# Altium schematic sheet StatusLEDSchem.SchDoc
size A4; SheetNumber: 1; SheetTotal: 1
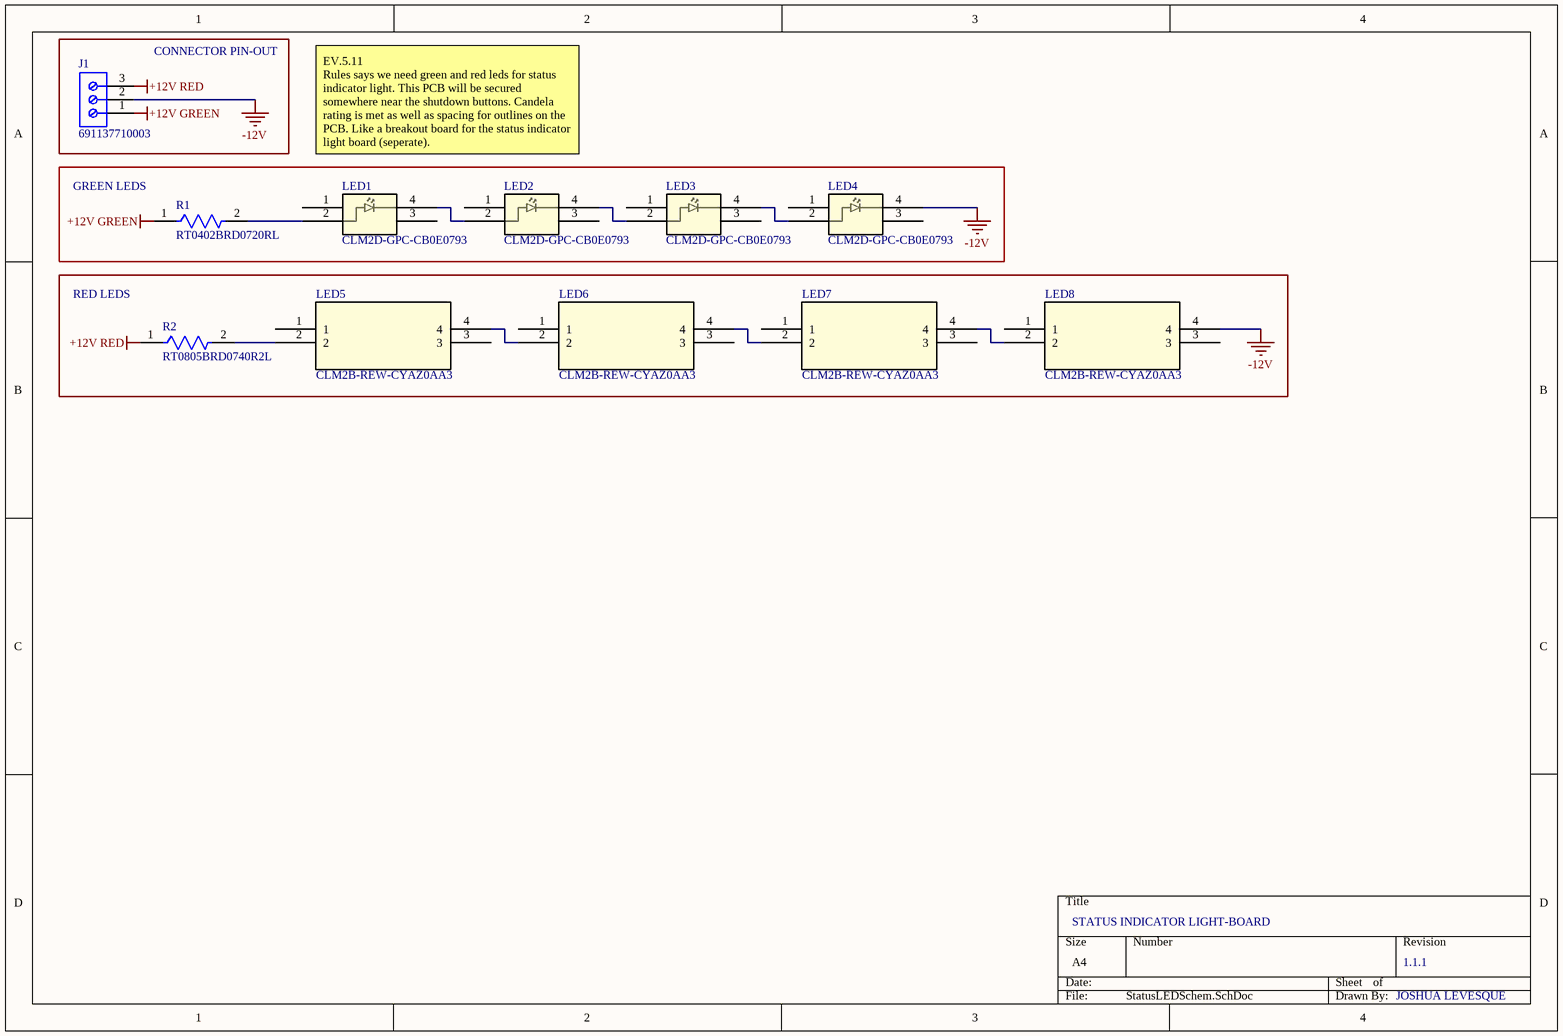
[diagram p0: StatusLEDSchem.SchDoc]

## Parts
J1  691137710003  [691137710003]
LED1  CLM2D-GPC-CB0E0793  [PLCC4_3.5X2.8X3.45_CRW]
LED2  CLM2D-GPC-CB0E0793  [PLCC4_3.5X2.8X3.45_CRW]
LED3  CLM2D-GPC-CB0E0793  [PLCC4_3.5X2.8X3.45_CRW]
LED4  CLM2D-GPC-CB0E0793  [PLCC4_3.5X2.8X3.45_CRW]
LED5  CLM2B-REW-CYAZ0AA3  [PLCC4_CLM2B_3P2X2P7_CRE]
LED6  CLM2B-REW-CYAZ0AA3  [PLCC4_CLM2B_3P2X2P7_CRE]
LED7  CLM2B-REW-CYAZ0AA3  [PLCC4_CLM2B_3P2X2P7_CRE]
LED8  CLM2B-REW-CYAZ0AA3  [PLCC4_CLM2B_3P2X2P7_CRE]
R1  RT0402BRD0720RL  [FP-RT0402-0_35-MFG]
R2  RT0805BRD0740R2L  [FP-RT0805-MFG]

## Blocks framed on the sheet
CONNECTOR PIN-OUT: J1
GREEN LEDS: LED1-LED4 R1
RED LEDS: LED5-LED8 R2

## Nets
+12V GREEN: J1.1 R1.1
+12V RED: J1.3 R2.1
-12V: J1.2 LED4.4 LED8.4
NetLED1_2: LED1.2 R1.2
NetLED1_4: LED1.4 LED2.2
NetLED2_4: LED2.4 LED3.2
NetLED3_4: LED3.4 LED4.2
NetLED5_2: LED5.2 R2.2
NetLED5_4: LED5.4 LED6.2
NetLED6_4: LED6.4 LED7.2
NetLED7_4: LED7.4 LED8.2

Not connected (* = marked no-connect by the designer): LED1 1 3; LED2 1 3; LED3 1 3; LED4 1 3; LED5 1 3; LED6 1 3; LED7 1 3; LED8 1 3

## Notes on the sheet
- EV.5.11
  Rules says we need green and red leds for status indicator light. This PCB will be secured somewhere near the shutdown buttons. Candela rating is met as well as spacing for outlines on the PCB. Like a breakout board for the status indicator light board (seperate).
- STATUS INDICATOR LIGHT-BOARD
- 1.1.1
- JOSHUA LEVESQUE

## Library data of the parts
J1 = CMP-1502-03325-2: NexarPartId: 78871138; Number of Pins: 3; Packaging: Box; RoHS: Non-Compliant; Lead Pitch: 5mm
LED1-LED4 = CLM2D-GPC-CB0E0793: No Description Available; Mfr_Name: Wolfspeed; RefDes: RefDes; Type: Type
LED5-LED8 = CLM2B-REW-CYAZ0AA3: No Description Available; Mfr_Name: Wolfspeed; RefDes: RefDes; Type: Type
R1 = CMP-2002-02937-3: RES SMD 20 OHM 0.1% 1/16W 0402; Voltage Rating: 50V; Max Power Dissipation: 63mW; Resistance: 20R; Temperature Coefficient: 25ppm/°C; Power Rating: 62.5mW; Width: 0.02inch; Termination: SMD/SMT; Packaging: Tape and Reel; Package Quantity: 10000; Voltage Rating (DC): 50V; Weight: 2.3E-05oz; Length: 0.039inch; Min Operating Temperature: -55°C; Max Operating Temperature: 125°C; Lead Free: Lead Free; Case/Package: 0402; Number of Terminations: 2; Series: RT; Case Code (Metric): 1005; Height: 0.014inch; Resistor Type: Thin Film; RoHS Compliant: Yes; Tolerance: 0.1%; Case Code (Imperial): 0402; Size Code: 0402
R2 = CMP-03412-036233-1: RES SMD 40.2 OHM 0.1% 1/8W 0805; Manufacturer: Yageo; Value: 40.2Ω; Voltage Rating: 150V; Power Rating: 0.125W; Tolerance: 0.0025; Temperature Coefficient: 25 ppm/°C; Description: RT0805 40.2Ω 0.125W 25 ppm/°C 0.25%; Automotive: No; Mouser Description: Thin Film Resistors - SMD 1/8W 40.2 ohm .1% 25ppm; ComponentLink2URL: http://www.yageo.com/documents/recent/PYu-RT_1-to-0.01_RoHS_L_9.pdf; ComponentLink2Description: Datasheet; Height: 0.6mm; Resistance: 40.2Ω; Digikey Description: RES SMD 40.2 OHM 0.1% 1/8W 0805; Series: RT; Octopart: https://octopart.com/rt0805brd0740r2l-yageo-1269193; RoHS: TRUE; Composition: Thin Film; Device Class L2: Resistors; Temperature Range Low: -55°C; Manufacturer Part Number: RT0805BRD0740R2L; Device Class L1: Passive Components; Temperature Range High: +155°C; Lead Free: Yes; Temperature: -55°C to +155°C; Device Class L3: Chip SMD Resistors; Ipc Land Pattern Name: RESC200125X50; Category: Res; Package: RT0805; Footprint Url: http://www.yageo.com/exep/pages/download/literatures/PYu-R_Mount_10.pdf